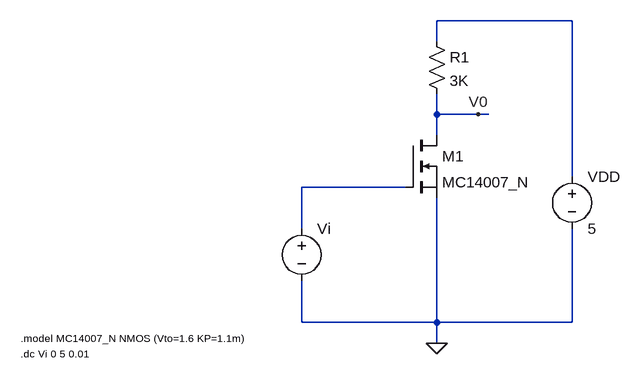
[diagram p0: schematic 1.2.1.asc]
1.2.1.asc, the LTspice schematic file:
Version 4
SHEET 1 880 680
WIRE 624 -208 416 -208
WIRE 416 -176 416 -208
WIRE 416 -64 416 -96
WIRE 480 -64 416 -64
WIRE 496 -64 480 -64
WIRE 416 -32 416 -64
WIRE 624 32 624 -208
WIRE 368 48 208 48
WIRE 208 112 208 48
WIRE 208 256 208 192
WIRE 416 256 416 64
WIRE 416 256 208 256
WIRE 624 256 624 112
WIRE 624 256 416 256
WIRE 416 288 416 256
FLAG 416 288 0
FLAG 480 -64 V0
SYMBOL voltage 208 96 R0
SYMATTR InstName Vi
SYMATTR Value ""
SYMBOL voltage 624 16 R0
WINDOW 123 0 0 Left 0
WINDOW 39 0 0 Left 0
SYMATTR InstName VDD
SYMATTR Value 5
SYMBOL nmos 368 -32 R0
SYMATTR InstName M1
SYMATTR Value MC14007_N
SYMBOL res 400 -192 R0
SYMATTR InstName R1
SYMATTR Value 3K
TEXT -224 280 Left 1 !.model MC14007_N NMOS (Vto=1.6 KP=1.1m)
TEXT -224 304 Left 1 !.dc Vi 0 5 0.01

The netlist it stands for:
* 1.2.1.asc
Vi N002 0
VDD N001 0 5
M1 V0 N002 0 0 MC14007_N
R1 N001 V0 3K
.model NMOS NMOS
.model PMOS PMOS
.lib standard.mos
.model MC14007_N NMOS (Vto=1.6 KP=1.1m)
.dc Vi 0 5 0.01
.backanno
.end

* Results of the author's LTspice run, read from the files saved beside the schematic
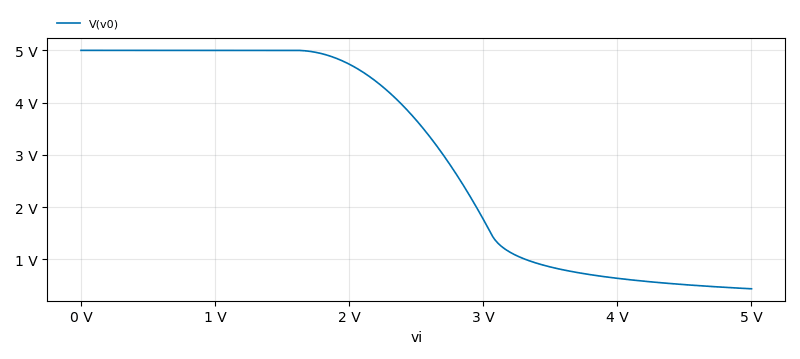
[diagram p1: DC transfer characteristic of 1.2.1.asc, plotted from the saved traces]
* DC transfer characteristic, 1 run:
*   V(v0): 5 V at vi=0 V, 434.7 mV at vi=5 V, min 434.7 mV, max 5 V